# EAGLE design atto-touch (EAGLE 9.5.1)
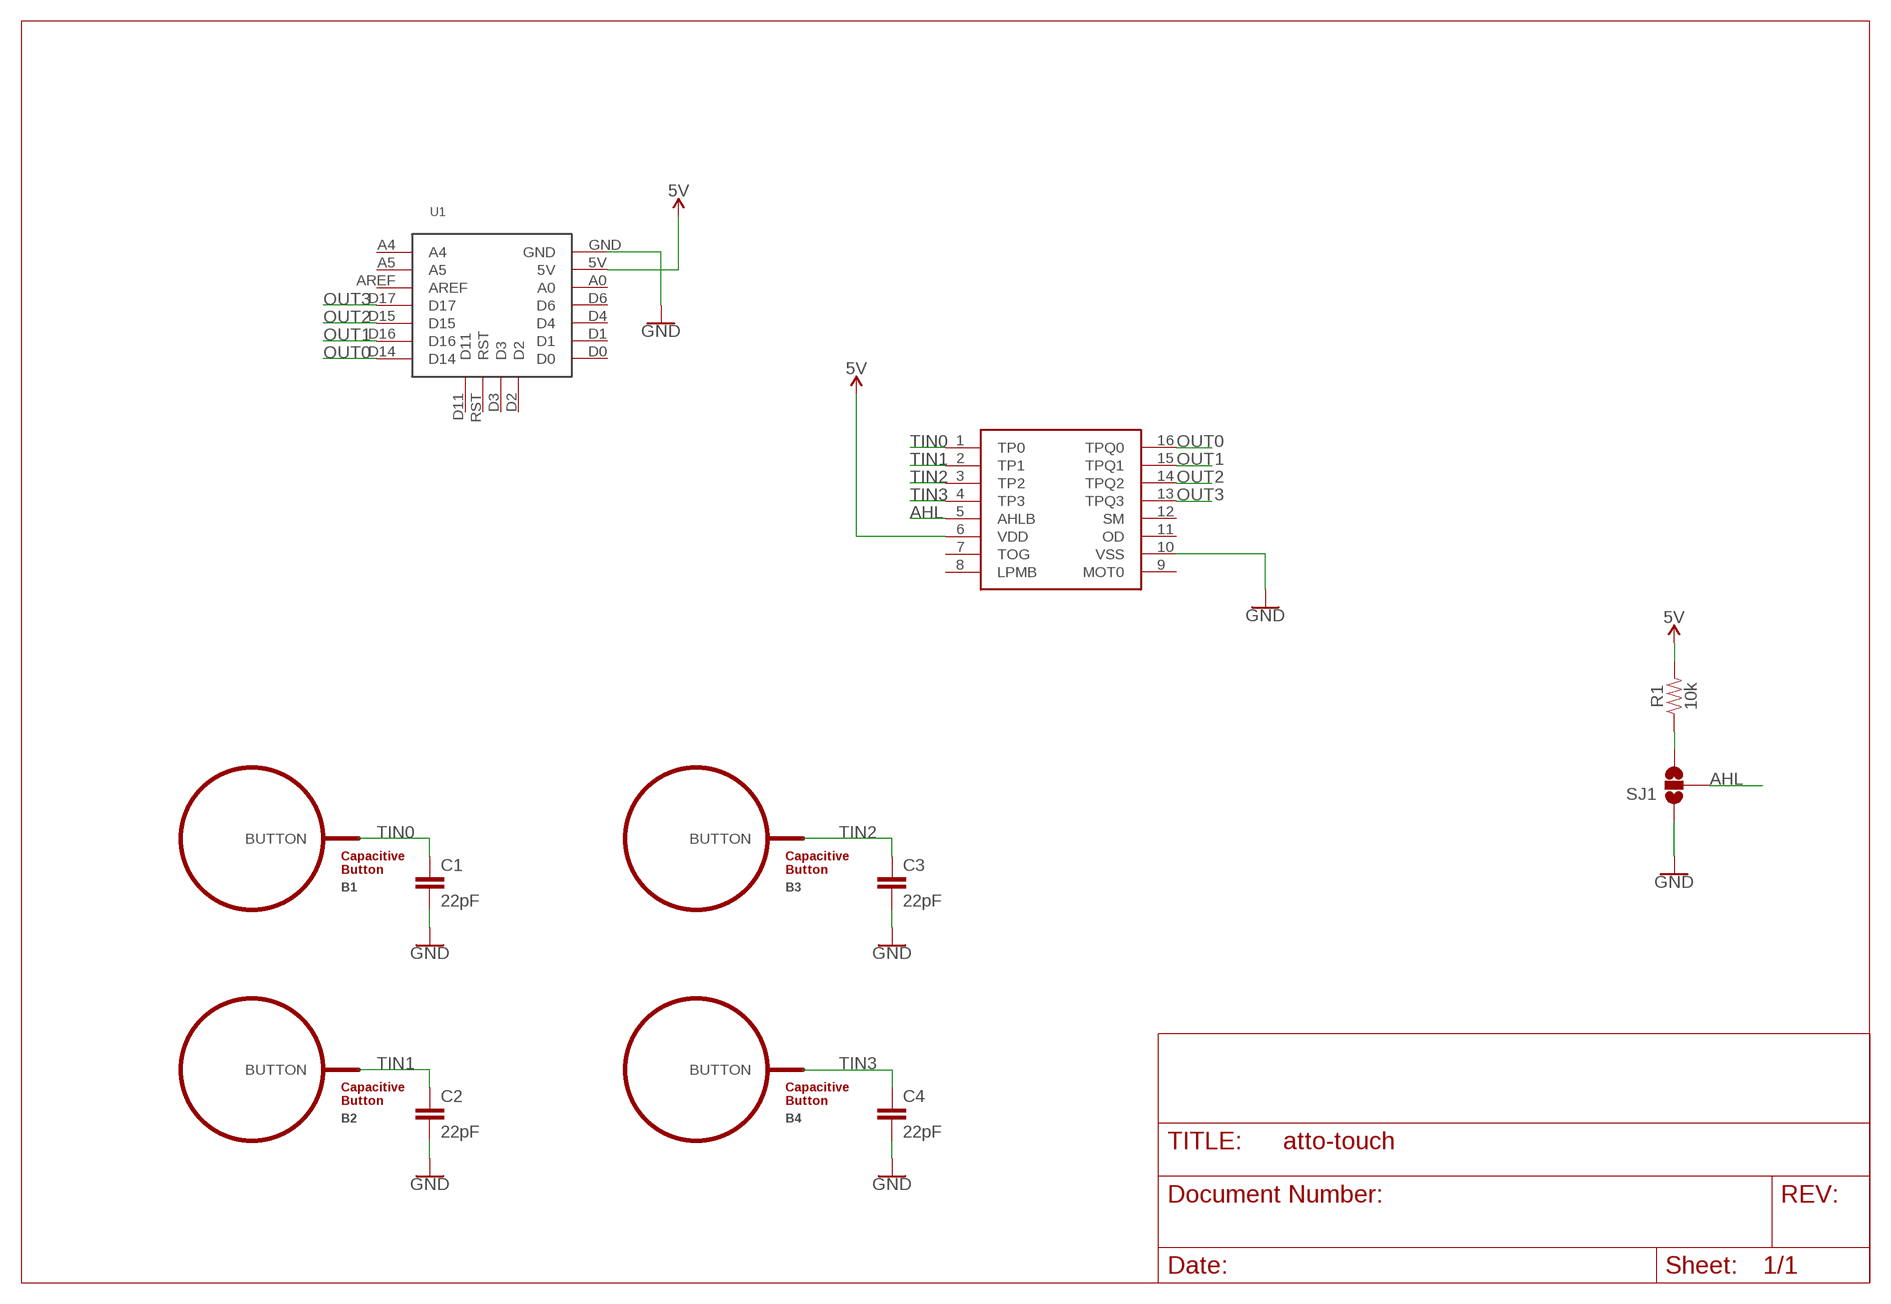
[diagram p0: schematic, sheet 1]

## Parts
B1  BUTTON_PASSIVE10MM  [BUTTON_PASSIVE_10MM]
B2  BUTTON_PASSIVE10MM  [BUTTON_PASSIVE_10MM]
B3  BUTTON_PASSIVE10MM  [BUTTON_PASSIVE_10MM]
B4  BUTTON_PASSIVE10MM  [BUTTON_PASSIVE_10MM]
C1  22pF  22PF-0603-50V-5%  [0603]
C2  22pF  22PF-0603-50V-5%  [0603]
C3  22pF  22PF-0603-50V-5%  [0603]
C4  22pF  22PF-0603-50V-5%  [0603]
R1  10k  10KOHM-0603-1/10W-1%  [0603]
SJ1  SOLDERJUMPER_2WAYS  [SJ_3]
U1  PIKSEY_ATTO  [PIKSEY_ATTO]
U2  TTP224  [SSOP-16]

## Nets
5V: R1.2 U1.5V U2.6(VDD)
AHL: SJ1.2 U2.5(AHLB)
GND: C1.2 C2.2 C3.2 C4.2 SJ1.1 U1.GND U2.10(VSS)
N$6: R1.1 SJ1.3
OUT0: U1.D14 U2.16(TPQ0)
OUT1: U1.D16 U2.15(TPQ1)
OUT2: U1.D15 U2.14(TPQ2)
OUT3: U1.D17 U2.13(TPQ3)
TIN0: B1.BUTTON C1.1 U2.1(TP0)
TIN1: B2.BUTTON C2.1 U2.2(TP1)
TIN2: B3.BUTTON C3.1 U2.3(TP2)
TIN3: B4.BUTTON C4.1 U2.4(TP3)
Unconnected: U1.A0 U1.A4 U1.A5 U1.AREF U1.D0 U1.D1 U1.D2 U1.D3 U1.D4 U1.D6 U1.D11 U1.RST U2.7(TOG) U2.8(LPMB) U2.9(MOT0) U2.11(OD) U2.12(SM)

## Library data of the parts
B1-B4 = PatternAgents-TouchWidgets:BUTTON_PASSIVE: Button, Passive Capacitive/Touch Sensing Type Source : http://www.PatternAgents.com Github : https://github.com/PatternAgents License : http://creativecommons.org/licenses/by-sa/3.1/ (Creative Commons 3.1) THIS SOFTWARE IS PROVIDED BY THE CONTRIBUTORS "AS IS" AND WITHOUT ANY EXPRESS OR IMPLIED WARRANTIES, INCLUDING, BUT NOT LIMITED TO, THE IMPLIED WARRANTIES OF MERCHANTABILITY AND FITNESS FOR A PARTICULAR PURPOSE ARE DISCLAIMED. IN NO EVENT SHALL THE COPYRIGHT OWNER OR CONTRIBUTORS BE LIABLE FOR ANY DIRECT, INDIRECT, INCIDENTAL, SPECIAL, EXEMPLARY, OR CONSEQUENTIAL DAMAGES (INCLUDING, BUT NOT LIMITED TO, PROCUREMENT OF SUBSTITUTE GOODS OR SERVICES; LOSS OF USE, DATA, OR PROFITS; OR BUSINESS INTERRUPTION) HOWEVER CAUSED AND ON ANY THEORY OF LIABILITY, WHETHER IN CONTRACT, STRICT LIABILITY, OR TORT (INCLUDING NEGLIGENCE OR OTHERWISE) ARISING IN ANY WAY OUT OF THE USE OF THIS SOFTWARE, EVEN IF ADVISED OF THE POSSIBILITY OF SUCH DAMAGE.
C1-C4 = SparkFun-Capacitors:22PF: 22pF ceramic capacitors A capacitor is a passive two-terminal electrical component used to store electrical energy temporarily in an electric field.; PROD_ID: CAP-07876
R1 = SparkFun-Resistors:10KOHM: 10kΩ resistor A resistor is a passive two-terminal electrical component that implements electrical resistance as a circuit element. Resistors act to reduce current flow, and, at the same time, act to lower voltage levels within circuits. - Wikipedia; PROD_ID: RES-00824
SJ1 = SparkFun-Retired:SOLDERJUMPER_2WAY: Solder Jumper 2 way solder jumper
U1 = Frenoy_Custom:PIKSEY_ATTO
U2 = Frenoy_Custom:TTP224

## Board
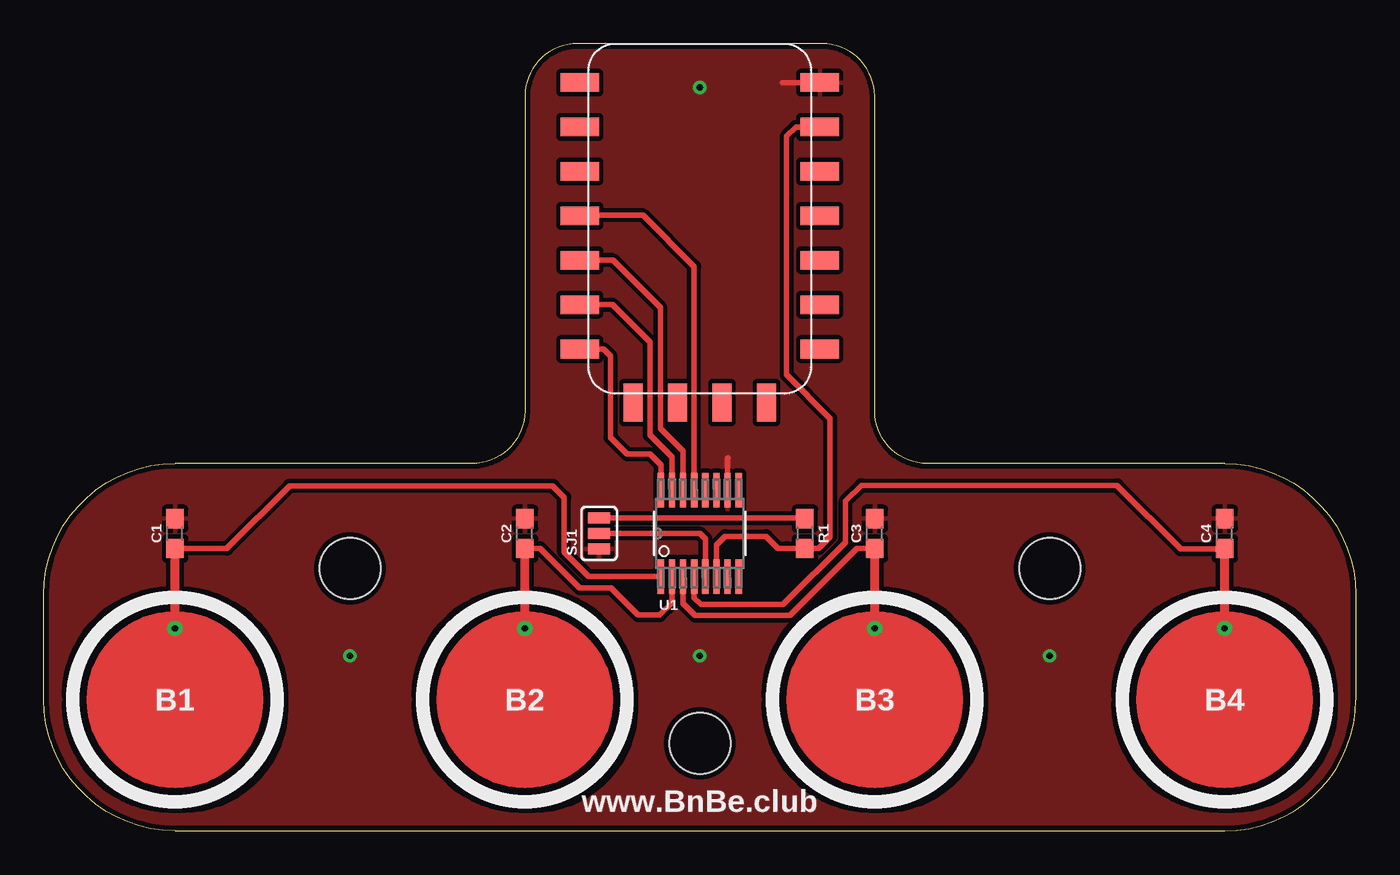
[diagram p1: board, top side]
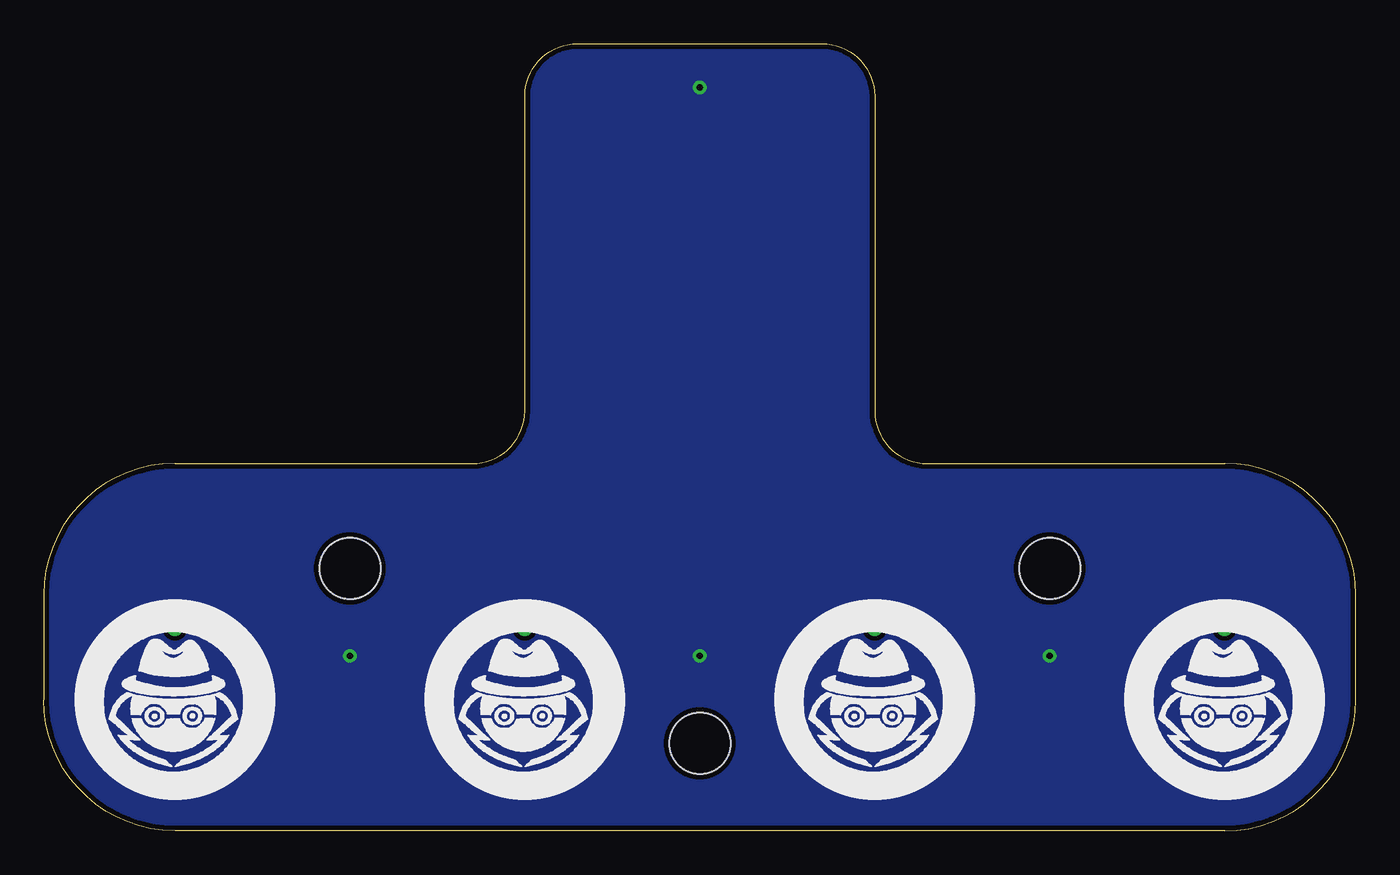
[diagram p2: board, bottom side, seen from below]

Size 75 x 45 mm. Coordinates in mm from the lower left corner, seen from the top.
Outline: 7.5,0 67.5,0 arc90 75,7.5 75,13.5 arc90 67.5,21 50.5,21 arc-90 47.5,24 47.5,42 arc90 44.5,45 30.5,45 arc90 27.5,42 27.5,24 arc-90 24.5,21 7.5,21 arc90 0,13.5 0,7.5 arc90 7.5,0
Copper layers (1*16): Top 0.035mm / dielectric 1.5mm / Bottom 0.035mm
Design rules "JLPCB_2L_Recommended_Use_this": minimum track width 8mil, minimum drill 0.3mm, track to track 8mil, track to pad 8mil, pad to pad 8mil, via to via 8mil, smd to smd 8mil, copper to edge 12mil, drill to drill 6mil, minimum pad ring 10mil, minimum via ring 8mil, stop-mask expansion 4mil, vias tented up to drill 20mil, thermal gap 10mil
Holes 3.5 mm at 17.5,15 37.5,5 57.5,15

### Footprints (pad centres in the part's own frame; a part is rotated, then mirrored left to right if it is on the bottom)
BUTTON_PASSIVE_10MM = drill 0.356: BUTTON 0,4.064
0603 = smd 1.1 x 1: 1 -0.85,0; 2 0.85,0
SJ_3 = smd 0.635 x 1.27: 1 -0.889,0; 2 0,0; 3 0.889,0
PIKSEY_ATTO = smd 2.184 x 1.067: 5V 6.858,15.24; A0 6.858,12.7; A4 -6.858,15.24; A5 -6.858,17.78; AREF -6.858,12.7; D0 6.858,2.54; D1 6.858,5.08; D4 6.858,7.62; D6 6.858,10.16; D14 -6.858,2.54; D15 -6.858,7.62; D16 -6.858,5.08; D17 -6.858,10.16; GND 6.858,17.78 | smd 1.067 x 2.184: D2 3.81,-0.508; D3 1.27,-0.508; D11 -3.81,-0.508; RST -1.27,-0.508
SSOP-16 = smd 1.981 x 0.356: 1 -2.464,2.223; 2 -2.464,1.587; 3 -2.464,0.953; 4 -2.464,0.318; 5 -2.464,-0.318; 6 -2.464,-0.953; 7 -2.464,-1.587; 8 -2.464,-2.223; 9 2.464,-2.223; 10 2.464,-1.587; 11 2.464,-0.953; 12 2.464,-0.318; 13 2.464,0.318; 14 2.464,0.953; 15 2.464,1.587; 16 2.464,2.223

### Placement (x,y rotation side)
B1  7.5,7.5 0 top
B2  27.5,7.5 0 top
B3  47.5,7.5 0 top
B4  67.5,7.5 0 top
C1  7.5,17 90 top
C2  27.5,17 90 top
C3  47.5,17 90 top
C4  67.5,17 90 top
R1  43.5,17 270 top
SJ1  31.75,17 90 top
U1  37.5,25 0 top
U2  37.5,17 90 top

### Tracks (layer width: path | path; a pad name or v marks a point on that pad's centre or on a via)
5V
  Top 0.305: U2.6 38.45,16.34 38.95,16.84 41.29,16.84 41.98,16.15 42.47,16.15 R1.2 44.29,16.15 44.95,16.81 44.95,23.58 42.46,26.08 42.46,39.71 42.99,40.24 U1.5V
AHL
  Top 0.305: U2.5 37.82,16.7 37.52,17 SJ1.2
GND  (via drill 0.35)
  Top 0.305: U2.10 39.09,21.28 39.12,21.31 | U1.GND 42.24,42.78 U1.GND
  other vias: 37.5,42.5 37.5,10 57.5,10 17.5,10
  pour Top (isolate 0.254): -0.88,46.56 -0.88,-0.09 76.57,-0.09 76.57,46.48 -0.7,46.48
  pour Bottom (isolate 0.254): -0.44,46.56 -0.44,-0.09 77.01,-0.09 77.01,46.48 -0.26,46.48
N$6
  Top 0.305: SJ1.3 43.46,17.89 R1.1
OUT0
  Top 0.305: U1.D14 32,27.54 32.39,27.14 32.39,22.5 33.35,21.54 34.65,21.54 35.28,20.91 U2.16
OUT1
  Top 0.305: U1.D16 32.51,30.08 34.65,27.93 34.65,22.62 35.91,21.36 U2.15
OUT2
  Top 0.305: U2.14 36.55,21.71 35.24,23.01 35.24,29.91 32.53,32.62 U1.D15
OUT3
  Top 0.305: U2.13 37.18,32.27 34.26,35.19 30.68,35.19 U1.D17
TIN0
  Top 0.305: C1.1 10.47,16.14 14.05,19.72 29.09,19.72 29.75,19.06 29.75,15.94 31.15,14.54 U2.1
  Top 0.508: B1.BUTTON C1.1
TIN1
  Top 0.305: U2.2 35.91,13.04 35.21,12.33 33.97,12.33 32.43,13.87 30.64,13.87 28.36,16.15 C2.1
  Top 0.508: B2.BUTTON C2.1
TIN2
  Top 0.305: U2.3 36.55,13 37.23,12.31 42.65,12.31 46.49,16.15 C3.1
  Top 0.508: B3.BUTTON C3.1
TIN3
  Top 0.305: U2.4 37.18,13.31 37.56,12.93 42.27,12.93 45.83,16.49 45.83,18.85 46.74,19.76 61.35,19.76 65,16.11 67.46,16.11 C4.1
  Top 0.508: B4.BUTTON C4.1

### Text on the board
tPlace: www.BnBe.club